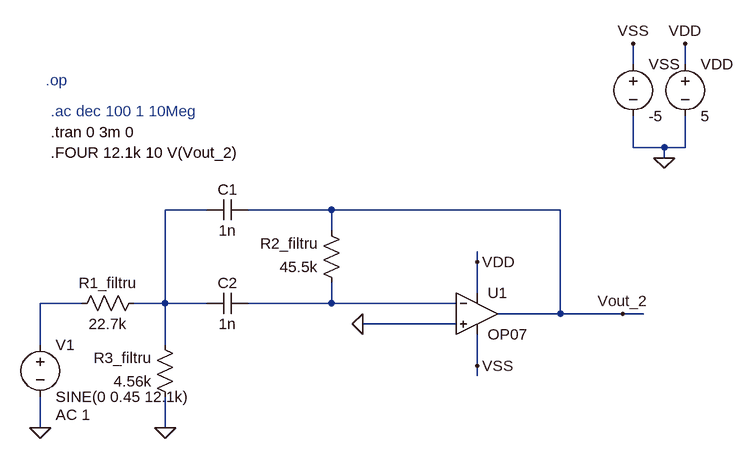
[diagram p0: schematic etajul2.asc]
etajul2.asc, the LTspice schematic file:
Version 4
SHEET 1 880 680
WIRE 544 -224 544 -256
WIRE 624 -224 624 -256
WIRE 544 -96 544 -144
WIRE 592 -96 544 -96
WIRE 624 -96 624 -144
WIRE 624 -96 592 -96
WIRE 592 -80 592 -96
WIRE -112 0 -176 0
WIRE 80 0 -48 0
WIRE 432 0 80 0
WIRE 80 32 80 0
WIRE 304 80 304 64
WIRE 304 128 304 80
WIRE -304 144 -368 144
WIRE -176 144 -176 0
WIRE -176 144 -224 144
WIRE -112 144 -176 144
WIRE 80 144 80 112
WIRE 80 144 -48 144
WIRE 272 144 80 144
WIRE 432 160 432 0
WIRE 432 160 336 160
WIRE 528 160 432 160
WIRE 560 160 528 160
WIRE 272 176 128 176
WIRE -368 208 -368 144
WIRE -176 208 -176 144
WIRE 304 240 304 192
WIRE 304 256 304 240
WIRE -368 336 -368 288
WIRE -176 336 -176 288
FLAG 528 160 Vout_2
FLAG 304 240 VSS
FLAG 304 80 VDD
FLAG 128 176 0
FLAG -176 336 0
FLAG -368 336 0
FLAG 592 -80 0
FLAG 544 -256 VSS
FLAG 624 -256 VDD
DATAFLAG -144 144 ""
DATAFLAG 128 144 ""
DATAFLAG 208 176 ""
DATAFLAG 400 160 ""
SYMBOL cap -48 16 M270
WINDOW 0 32 32 VTop 2
WINDOW 3 0 32 VBottom 2
SYMATTR InstName C1
SYMATTR Value 1n
SYMBOL res -208 128 R90
WINDOW 0 0 56 VBottom 2
WINDOW 3 32 56 VTop 2
SYMATTR InstName R1_filtru
SYMATTR Value 22.7k
SYMBOL res 96 128 R180
WINDOW 0 36 76 Left 2
WINDOW 3 36 40 Left 2
SYMATTR InstName R2_filtru
SYMATTR Value 45.5k
SYMBOL cap -112 160 R270
WINDOW 0 32 32 VTop 2
WINDOW 3 0 32 VBottom 2
SYMATTR InstName C2
SYMATTR Value 1n
SYMBOL res -160 304 R180
WINDOW 0 36 76 Left 2
WINDOW 3 36 40 Left 2
SYMATTR InstName R3_filtru
SYMATTR Value 4.56k
SYMBOL voltage -368 192 R0
WINDOW 123 24 124 Left 2
WINDOW 39 0 0 Left 0
SYMATTR Value2 AC 1
SYMATTR InstName V1
SYMATTR Value SINE(0 0.45 12.1k)
SYMBOL voltage 544 -240 R0
WINDOW 123 0 0 Left 0
WINDOW 39 0 0 Left 0
SYMATTR InstName VSS
SYMATTR Value -5
SYMBOL voltage 624 -240 R0
SYMATTR InstName VDD
SYMATTR Value 5
SYMBOL OpAmps\\OP07 304 96 R0
SYMATTR InstName U1
TEXT -360 -200 Left 2 ;.op
TEXT -352 -152 Left 2 ;.ac dec 100 1 10Meg
TEXT -352 -120 Left 2 !.tran 0 3m 0
TEXT -352 -88 Left 2 !.FOUR 12.1k 10 V(Vout_2)

The netlist it stands for:
* etajul2.asc
C1 Vout_2 N001 1n
R1_filtru N001 N002 22.7k
R2_filtru N003 Vout_2 45.5k
C2 N001 N003 1n
R3_filtru 0 N001 4.56k
V1 N002 0 SINE(0 0.45 12.1k) AC 1
VSS VSS 0 -5
VDD VDD 0 5
XU1 0 N003 VDD VSS Vout_2 LT1001  ; OP07, pins In+ In- V+ V- OUT
* .op
* .ac dec 100 1 10Meg
.tran 0 3m 0
.FOUR 12.1k 10 V(Vout_2)
.lib LTC.lib
.backanno
.end